# EAGLE design test_brd_gnd (EAGLE 9.5.2)
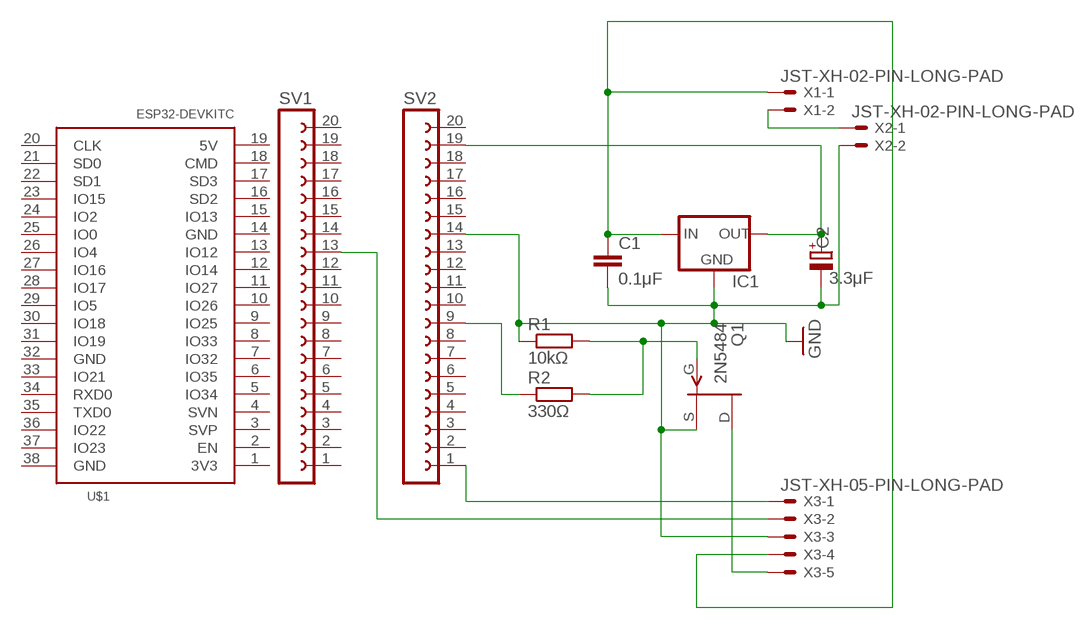
[diagram p0: schematic, sheet 1]

## Parts
C1  0.1μF  C-EU025-040X050  [C025-040X050]
C2  3.3μF  CPOL-EUE2.5-5  [E2,5-5]
IC1  78XXS  [78XXS]
Q1  2N5484  [TO92-]
R1  10kΩ  R-EU_0207/10  [0207/10]
R2  330Ω  R-EU_0207/10  [0207/10]
SV1  FE20-1  [FE20]
SV2  FE20-1  [FE20]
U$1  ESP32DEVKITC  [ESP32-DEVKITC]
X1  JST-XH-02-PIN-LONG-PAD  [JST-XH-02-PACKAGE-LONG-PAD]
X2  JST-XH-02-PIN-LONG-PAD  [JST-XH-02-PACKAGE-LONG-PAD]
X3  JST-XH-05-PIN-LONG-PAD  [JST-XH-05-PACKAGE-LONG-PAD]

## Nets
GND: C1.2 C2.- IC1.GND Q1.2(S) R1.1 SV2.14 X2.2 X3.3
N$1: C1.1 IC1.IN X1.1 X3.4
N$2: C2.+ IC1.OUT SV2.19
N$4: Q1.1(G) R1.2 R2.2
N$5: R2.1 SV2.9
N$6: X1.2 X2.1
N$7: SV2.1 X3.1
N$8: SV1.13 X3.2
N$9: Q1.3(D) X3.5
Unconnected: SV1.1 SV1.2 SV1.3 SV1.4 SV1.5 SV1.6 SV1.7 SV1.8 SV1.9 SV1.10 SV1.11 SV1.12 SV1.14 SV1.15 SV1.16 SV1.17 SV1.18 SV1.19 SV1.20 SV2.2 SV2.3 SV2.4 SV2.5 SV2.6 SV2.7 SV2.8 SV2.10 SV2.11 SV2.12 SV2.13 SV2.15 SV2.16 SV2.17 SV2.18 SV2.20 U$1.1(3V3) U$1.2(EN) U$1.3(SVP) U$1.4(SVN) U$1.5(IO34) U$1.6(IO35) U$1.7(IO32) U$1.8(IO33) U$1.9(IO25) U$1.10(IO26) U$1.11(IO27) U$1.12(IO14) U$1.13(IO12) U$1.14(GND) U$1.15(IO13) U$1.16(SD2) U$1.17(SD3) U$1.18(CMD) U$1.19(5V) U$1.20(CLK) U$1.21(SD0) U$1.22(SD1) U$1.23(IO15) U$1.24(IO2) U$1.25(IO0) U$1.26(IO4) U$1.27(IO16) U$1.28(IO17) U$1.29(IO5) U$1.30(IO18) U$1.31(IO19) U$1.32(GND) U$1.33(IO21) U$1.34(RXD0) U$1.35(TXD0) U$1.36(IO22) U$1.37(IO23) U$1.38(GND)

## Library data of the parts
C1 = resistor:C-EU: CAPACITOR, European symbol
C2 = resistor:CPOL-EU: POLARIZED CAPACITOR, European symbol
IC1 = v-reg:78XXS: VOLTAGE REGULATOR
Q1 = transistor-fet:?548*: N-Channel JFETs Source: VISHAY 2N5484.pdf Compatible: TO92 2N5245 J304 J305 U310 J308 J309 J310 TO72 2N4416 2N4416A 2N3823 2N4351 3N169 3N170 3N171 MFE3002 TO18 2N3796 2N3797 MFE825 Source: Motorola European Master Guide Pacge 3-59
R1 R2 = resistor:R-EU_: RESISTOR, European symbol
SV1 SV2 = con-lsta:FE20-1: FEMALE HEADER; OC_FARNELL: unknown; OC_NEWARK: unknown
U$1 = ESP32-DEVKITC:ESP32DEVKITC
X1 X2 = Rembrandt Electronics - JST XH Connectors v1-0:JST-XH-02-PIN: JST XH Connector 2 Pin Wire to board connector. Pitch: 2,54 mm, (0.100") Number of pins: 2 Created by Rembrandt Electronics www.rembrandtelectronics.com
X3 = Rembrandt Electronics - JST XH Connectors v1-0:JST-XH-05-PIN: JST XH Connector 2 Pin Wire to board connector. Pitch: 2,54 mm, (0.100") Number of pins: 5 Created by Rembrandt Electronics www.rembrandtelectronics.com

## Board
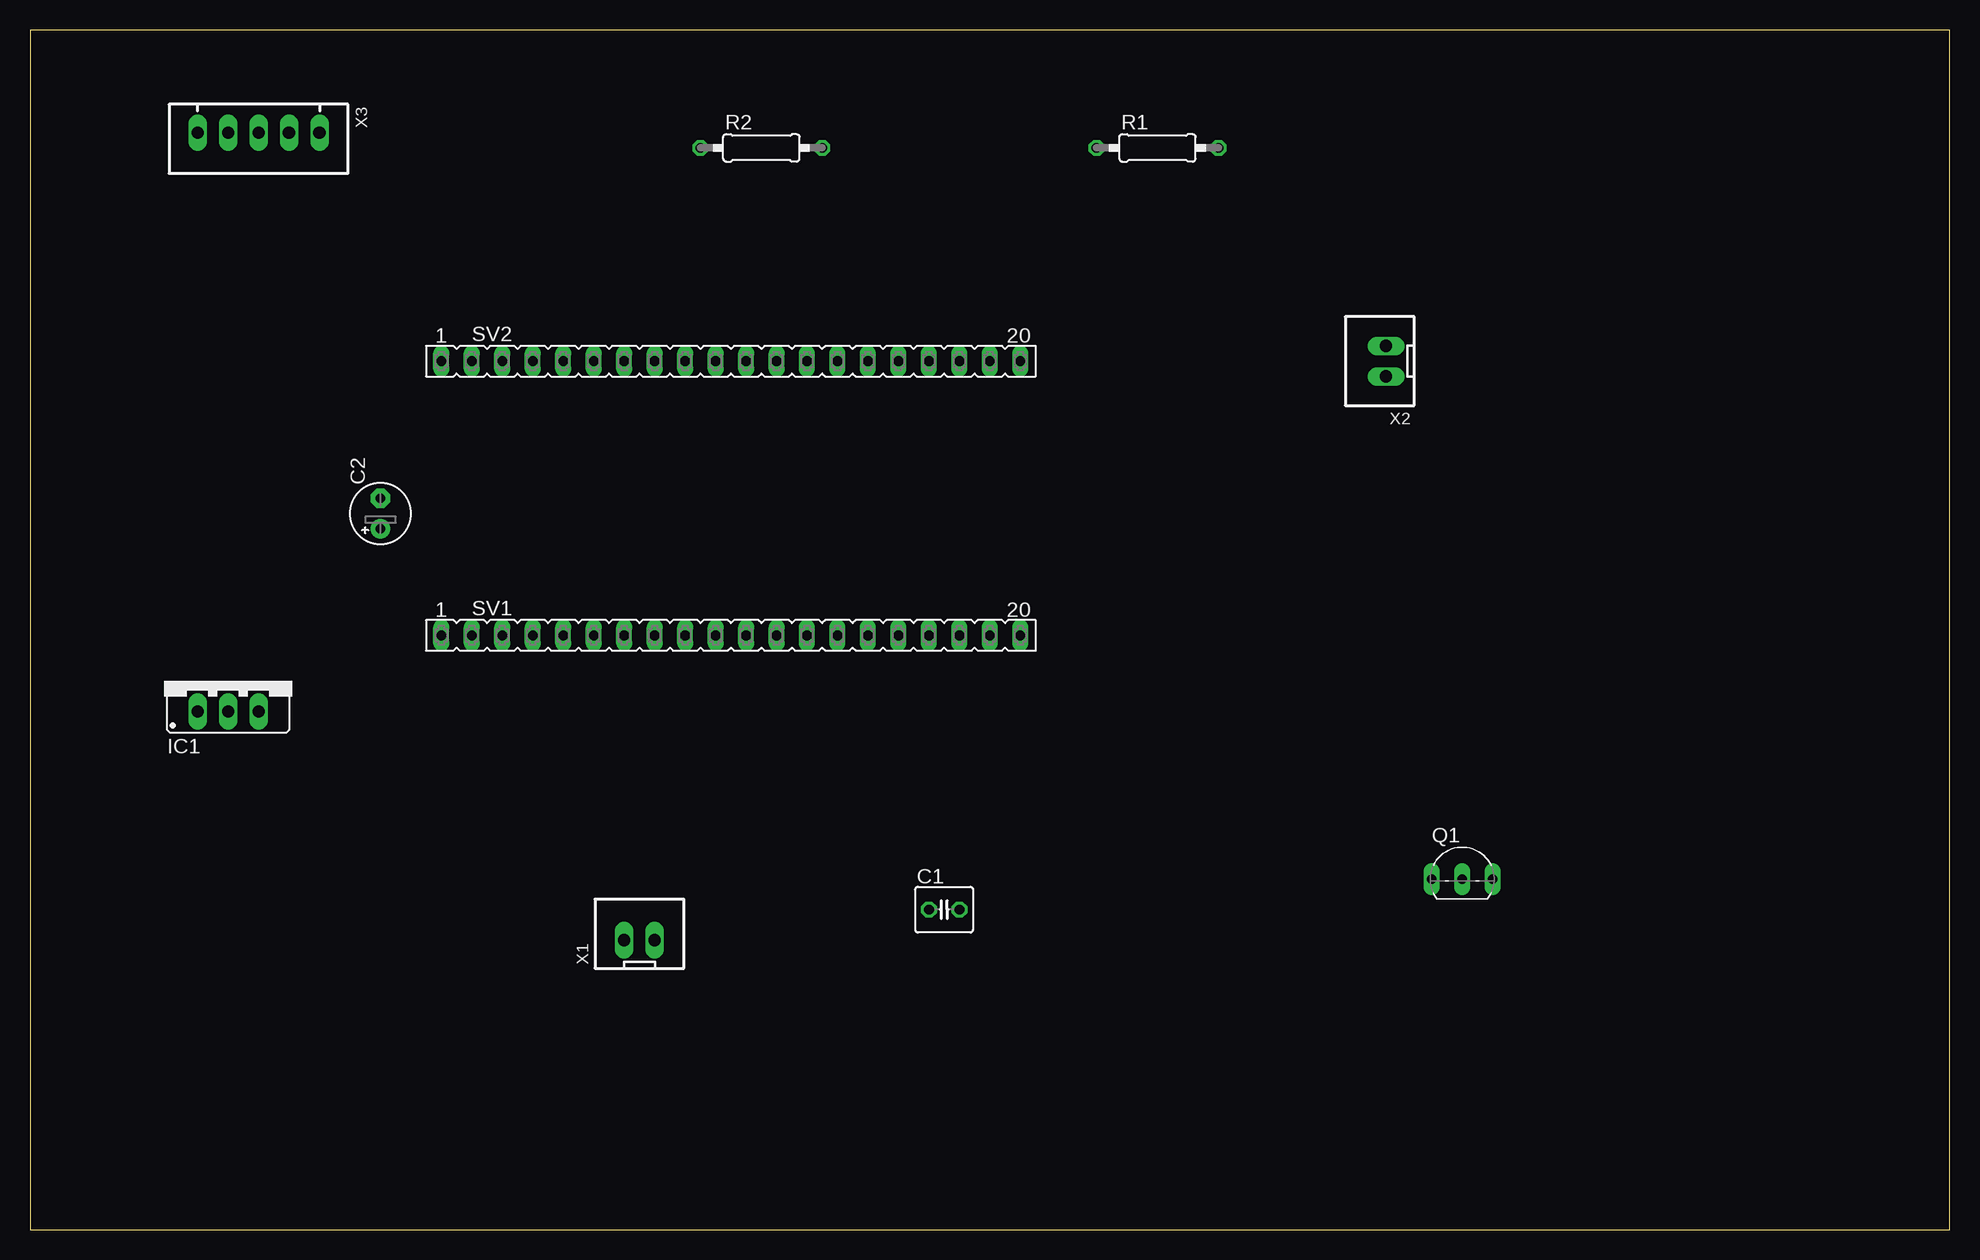
[diagram p1: board, top side]
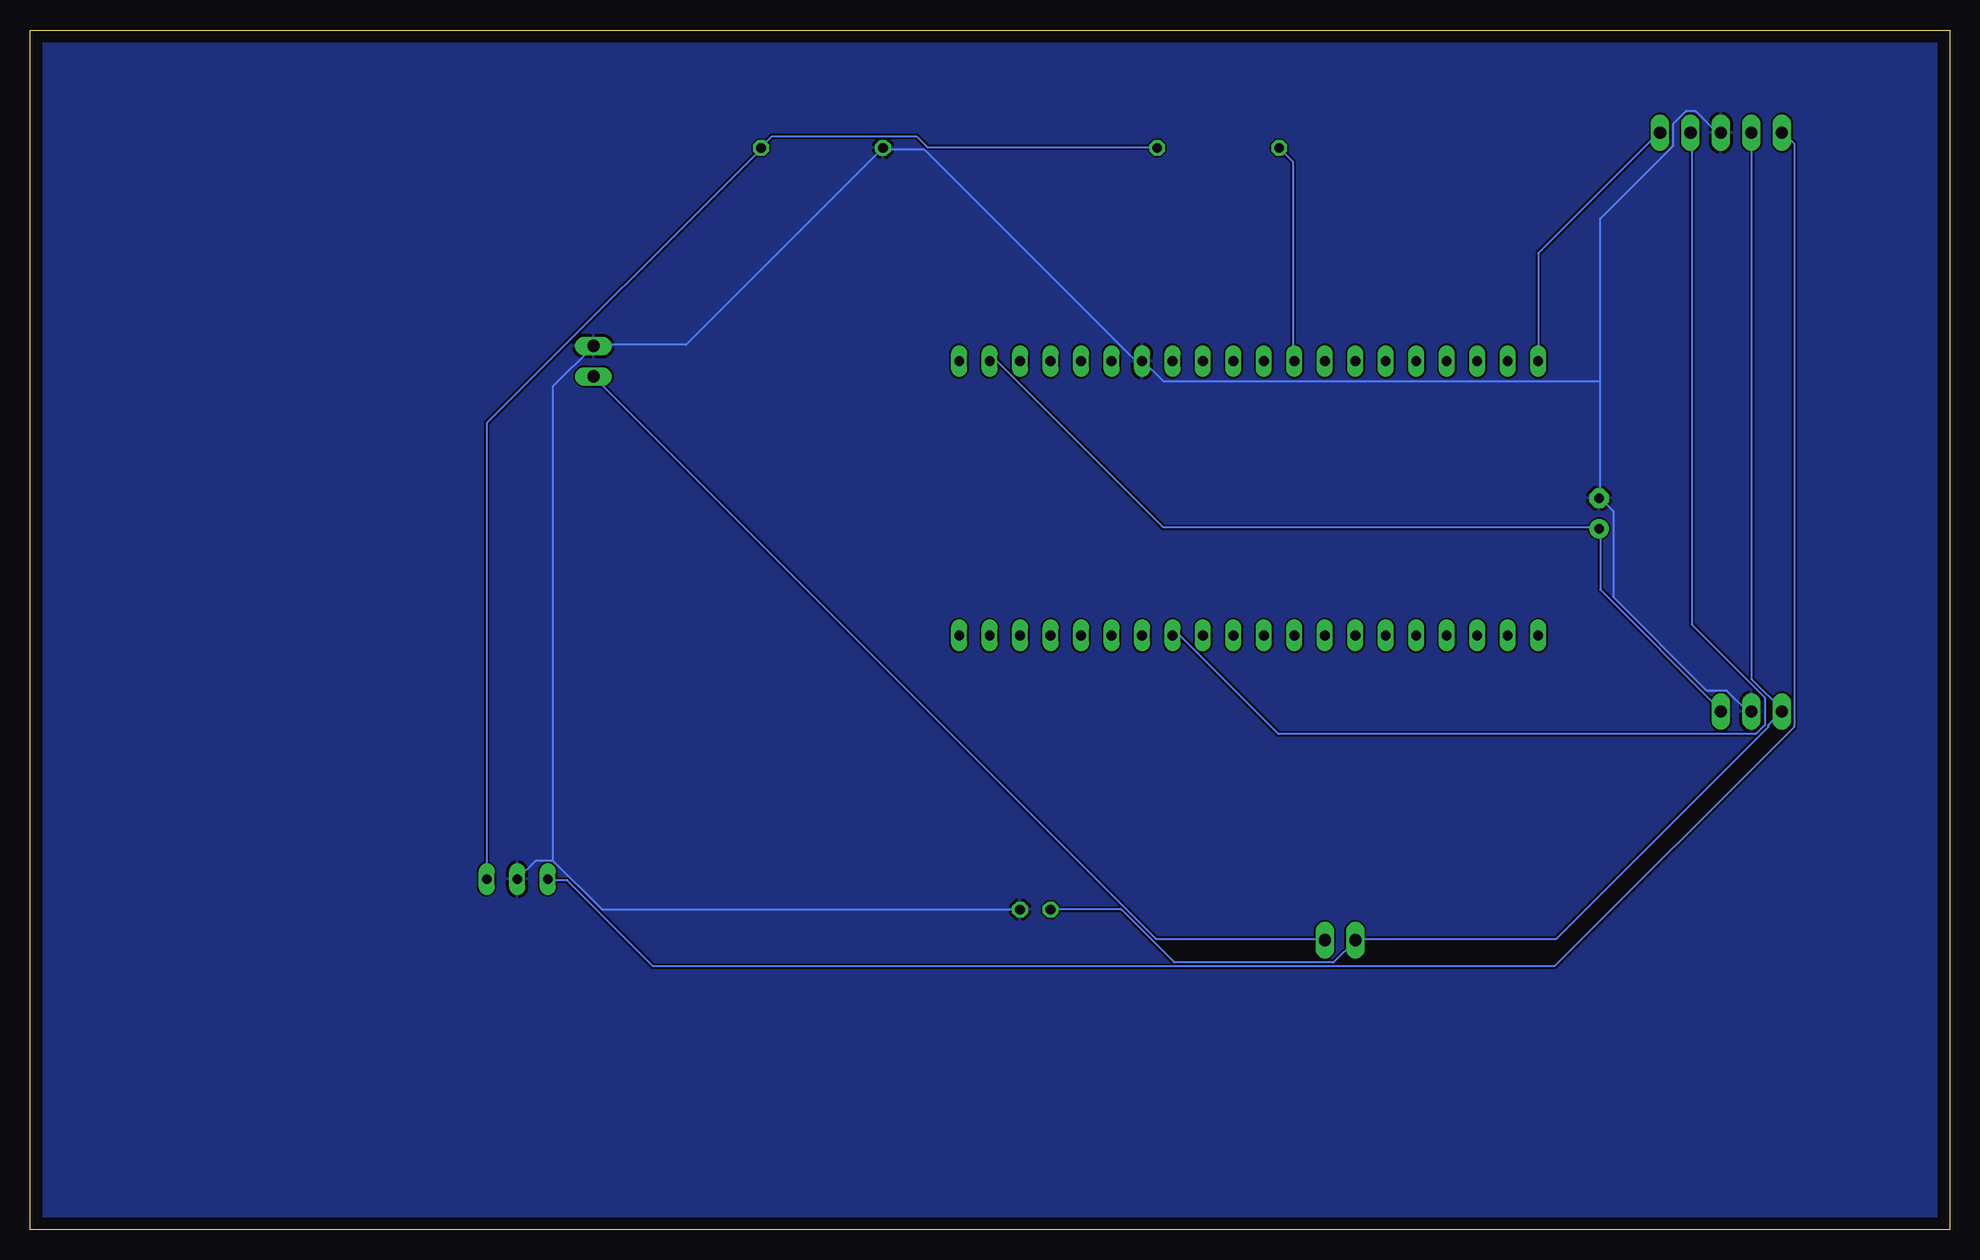
[diagram p2: board, bottom side, seen from below]

Size 160 x 100 mm. Coordinates in mm from the lower left corner, seen from the top.
Outline: 0,0 160,0 160,100 0,100 0,0
Copper layers (1*16): Top 0.035mm / dielectric 1.5mm / Bottom 0.035mm
Design rules "default": minimum track width 6mil, minimum drill 0.35mm, track to track 6mil, track to pad 6mil, pad to pad 6mil, via to via 6mil, smd to smd 6mil, copper to edge 40mil, drill to drill 6mil, minimum pad ring 10mil, minimum via ring 8mil, stop-mask expansion 4mil, vias tented up to drill 0mil, thermal gap 10mil

### Footprints (pad centres in the part's own frame; a part is rotated, then mirrored left to right if it is on the bottom)
C025-040X050 = drill 0.813 octagon: 1 -1.27,0; 2 1.27,0
E2,5-5 = drill 0.813 pad 1.6: + -1.27,0 | drill 0.813 pad 1.6 octagon: - 1.27,0
78XXS = drill 1.016 long: GND 0,-2.54; IN -2.54,-2.54; OUT 2.54,-2.54
TO92- = drill 0.813 long: 1 2.54,0; 2 0,0; 3 -2.54,0
0207/10 = drill 0.813 octagon: 1 -5.08,0; 2 5.08,0
FE20 = drill 0.813 long: 1 -24.13,0; 2 -21.59,0; 3 -19.05,0; 4 -16.51,0; 5 -13.97,0; 6 -11.43,0; 7 -8.89,0; 8 -6.35,0; 9 -3.81,0; 10 -1.27,0; 11 1.27,0; 12 3.81,0; 13 6.35,0; 14 8.89,0; 15 11.43,0; 16 13.97,0; 17 16.51,0; 18 19.05,0; 19 21.59,0; 20 24.13,0
ESP32-DEVKITC = drill 1 pad 1.93: 1 -22.87,-11.42; 2 -20.33,-11.42; 3 -17.79,-11.42; 4 -15.25,-11.42; 5 -12.71,-11.42; 6 -10.17,-11.42; 7 -7.63,-11.42; 8 -5.09,-11.42; 9 -2.55,-11.42; 10 -0.01,-11.42; 11 2.53,-11.42; 12 5.07,-11.42; 13 7.61,-11.42; 14 10.15,-11.42; 15 12.69,-11.42; 16 15.23,-11.42; 17 17.77,-11.42; 18 20.31,-11.42; 19 22.85,-11.42; 20 22.85,11.23; 21 20.31,11.23; 22 17.77,11.23; 23 15.23,11.23; 24 12.69,11.23; 25 10.15,11.23; 26 7.61,11.23; 27 5.07,11.23; 28 2.53,11.23; 29 -0.01,11.23; 30 -2.55,11.23; 31 -5.09,11.23; 32 -7.63,11.23; 33 -10.17,11.23; 34 -12.71,11.23; 35 -15.25,11.23; 36 -17.79,11.23; 37 -20.33,11.23; 38 -22.87,11.23
JST-XH-02-PACKAGE-LONG-PAD = drill 1.016 long: 1 -1.27,0; 2 1.27,0
JST-XH-05-PACKAGE-LONG-PAD = drill 1.016 long: 1 -5.08,0; 2 -2.54,0; 3 0,0; 4 2.54,0; 5 5.08,0

### Placement (x,y rotation side)
C1  76.2,26.67 0 top
C2  29.21,59.69 90 top
IC1  16.51,45.72 0 top
Q1  119.38,29.21 0 top
R1  93.98,90.17 0 top
R2  60.96,90.17 0 top
SV1  58.42,49.53 0 top
SV2  58.42,72.39 0 top
U$1  -38.1,16.51 0 top  (outside the outline)
X1  50.8,24.13 0 top
X2  113.03,72.39 90 top
X3  19.05,91.44 180 top

### Tracks (layer width: path | path; a pad name or v marks a point on that pad's centre or on a via)
GND
  Bottom 0.152: 29.11,60.96 28.04,59.89 28.04,52.73 20.27,44.96 18.59,44.96 16.92,43.28 16.61,43.28 IC1.GND | X3.3 19.36,91.44 21.18,93.27 21.95,93.27 23.01,92.2 23.01,90.37 29.11,84.28 29.11,70.71 | 29.11,60.96 29.11,70.71 | 29.11,60.96 C2.- | C1.2 112.32,26.67 116.43,30.79 | 116.43,30.79 117.81,30.79 Q1.2 | 116.43,30.79 116.43,70.26 X2.2 112.93,73.76 105.31,73.76 R1.1 88.85,90.07 85.5,90.07 67.82,72.39 SV2.14 67.21,72.39 65.53,70.71 29.11,70.71
  pour Bottom: 0,100.33 0,0 160.02,0 160.02,100.33
N$1
  Bottom 0.152: C1.1 69.04,26.67 64.62,22.25 51.36,22.25 49.53,24.08 X1.1 49.53,24.23 32.77,24.23 15.09,41.91 15.09,42.06 IC1.IN 13.87,43.28 16.46,45.87 16.46,91.44 X3.4
N$2
  Bottom 0.152: SV2.19 79.4,72.39 65.53,58.52 29.26,58.52 C2.+ 29.11,58.37 29.11,53.34 19.05,43.28 IC1.OUT
N$4
  Bottom 0.152: R2.2 66.14,90.22 85.19,90.22 86.11,91.14 98.15,91.14 99.06,90.22 R1.2 99.06,90.07 121.92,67.21 Q1.1
N$5
  Bottom 0.152: R2.1 54.71,89 54.71,72.39 SV2.9
N$6
  Bottom 0.152: X2.1 66.14,24.23 52.12,24.23 X1.2
N$7
  Bottom 0.152: SV2.1 34.29,81.38 24.23,91.44 X3.1
N$8
  Bottom 0.152: SV1.13 64.16,49.53 55.93,41.3 16.15,41.3 15.39,42.06 15.39,44.35 21.49,50.44 21.49,91.44 X3.2
N$9
  Bottom 0.152: Q1.3 116.74,29.11 115.21,29.11 108.05,21.95 32.92,21.95 12.95,41.91 12.95,90.53 13.87,91.44 X3.5